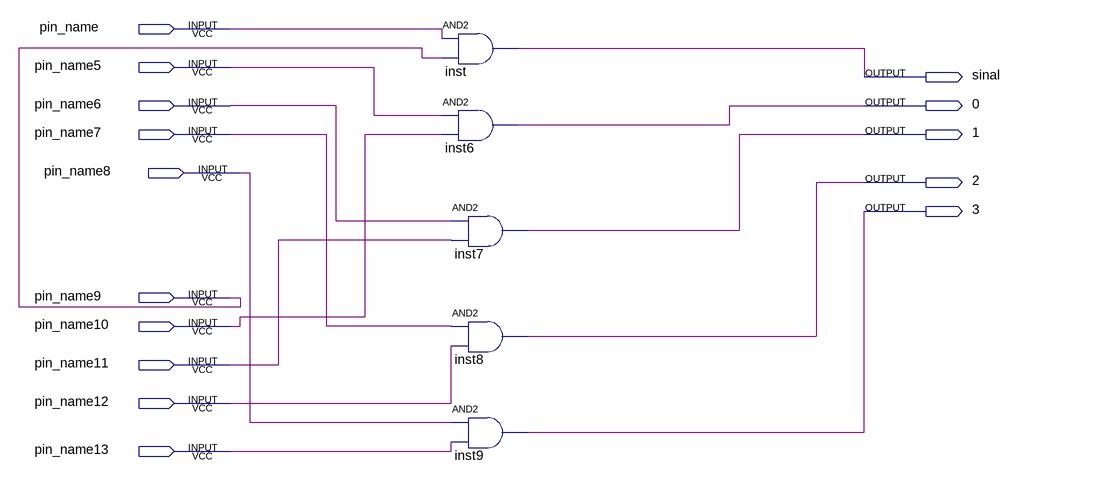
[diagram p0: schematic sheet]
// Quartus schematic funcao_and.bdf as structural Verilog: 5 symbols, 15 pins
module funcao_and (
  input  pin_name,
  input  pin_name5,
  input  pin_name6,
  input  pin_name7,
  input  pin_name8,
  input  pin_name9,
  input  pin_name10,
  input  pin_name11,
  input  pin_name12,
  input  pin_name13,
  output sinal,
  output \0 ,
  output \1 ,
  output \2 ,
  output \3 
);

  and inst (sinal, pin_name, pin_name9);
  and inst6 (\0 , pin_name5, pin_name10);
  and inst7 (\1 , pin_name6, pin_name11);
  and inst8 (\2 , pin_name7, pin_name12);
  and inst9 (\3 , pin_name8, pin_name13);
endmodule
